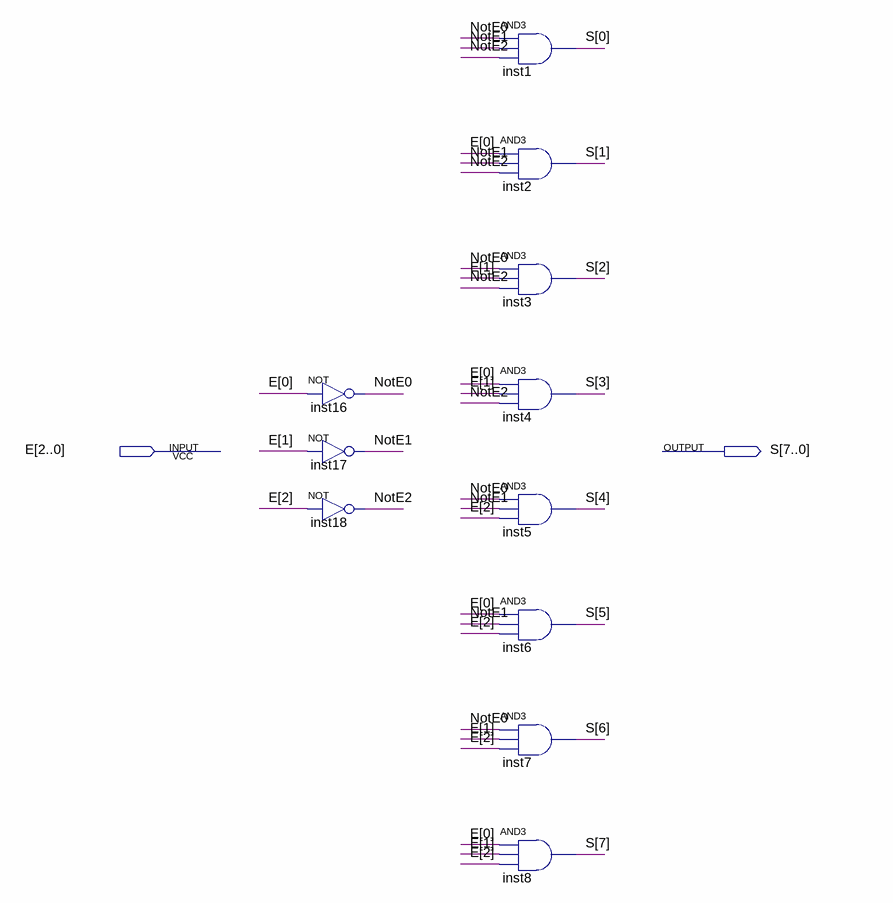
[diagram p0: schematic sheet]
// Quartus schematic decod38.bdf as structural Verilog: 11 symbols, 2 pins
module decod38 (
  input  [2:0] E,
  output [7:0] S
);

  wire NotE0, NotE1, NotE2;

  not inst16 (NotE0, E[0]);
  not inst17 (NotE1, E[1]);
  not inst18 (NotE2, E[2]);
  and inst1 (S[0], NotE0, NotE1, NotE2);
  and inst2 (S[1], E[0], NotE1, NotE2);
  and inst3 (S[2], NotE0, E[1], NotE2);
  and inst4 (S[3], E[0], E[1], NotE2);
  and inst5 (S[4], NotE0, NotE1, E[2]);
  and inst6 (S[5], E[0], NotE1, E[2]);
  and inst7 (S[6], NotE0, E[1], E[2]);
  and inst8 (S[7], E[0], E[1], E[2]);
endmodule
